# EAGLE schematic S130062_10HP_ECO_wd (EAGLE 6.5.0)

## Sheet 1 of 3
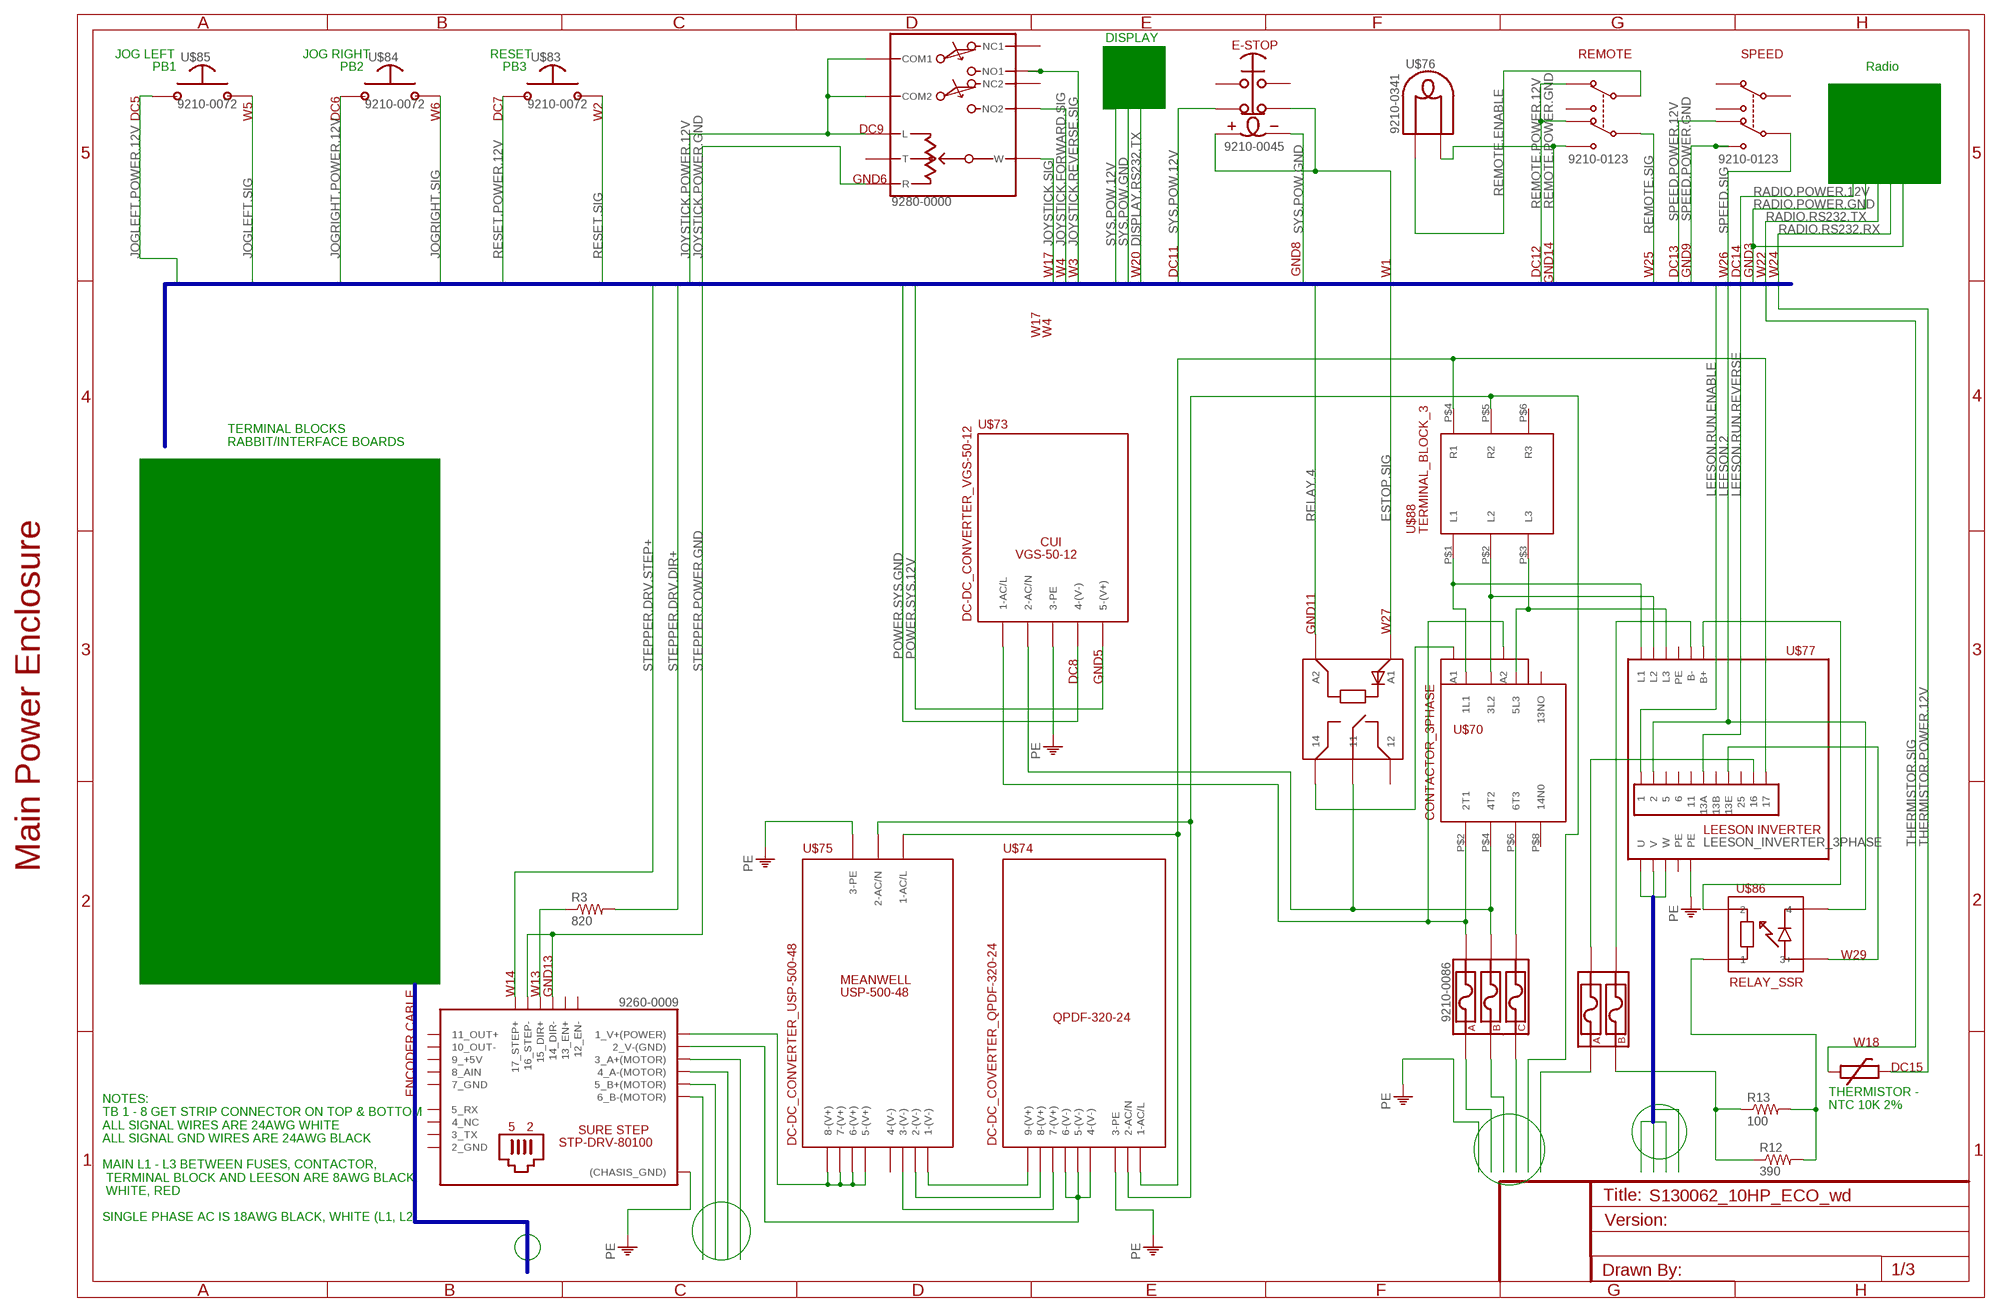
[diagram p0: schematic, sheet 1]

### Parts
R3  820  R-US_VTA52  [VTA52]
R12  390  R-US_VTA52  [VTA52]
R13  100  R-US_VTA52  [VTA52]
U$69  SURE_STEP_STP-DRV-80100  [BOGUS]
U$70  CONTACTOR_3PHASE  [BOGUS]
U$71  FUSE_HOLDER_3-POLE  [BOGUS]
U$72  9280-0000  JOYSTICK_PRO-5  [BOGUS]
U$73  DC-DC_CONVERTER_VGS-50-12  [BOGUS]
U$74  DC-DC_COVERTER_QPDF-320-24  [BOGUS]
U$75  DC-DC_CONVERTER_USP-500-48  [BOGUS]
U$76  9210-0341  INDICATOR_LIGHT  [BOGUS]
U$77  LEESON_INVERTER_3PHASE  [BOGUS]
U$78  THERMISTOR  [BOGUS]
U$79  9210-0045  SWITCH_ESTOP_LIGHTED  [BOGUS]
U$81  9210-0123  SWITCH_DPDT  [BOGUS]
U$82  9210-0123  SWITCH_DPDT  [BOGUS]
U$83  9210-0072  SWITCH_MOM_NO  [BOGUS]
U$84  9210-0072  SWITCH_MOM_NO  [BOGUS]
U$85  9210-0072  SWITCH_MOM_NO  [BOGUS]
U$86  RELAY_SSR  [BOGUS]
U$87  FUSE_HOLDER_2-POLE  [BOGUS]
U$88  TERMINAL_BLOCK_3  [BOGUS]
U$89  RELAY_TB  [BOGUS]

### Nets
B$5: U$77.P$20(U) U$77.P$21(V) U$77.P$22(W)
ESTOP.SIG: U$79.P$4 U$79.P$5 U$89.P$4(A1) ; also sheet 2
JOGLEFT.POWER.12V: U$85.P$1 ; also sheet 2
JOGLEFT.SIG: U$85.P$2 ; also sheet 2
JOGRIGHT.POWER.12V: U$84.P$1 ; also sheet 2
JOGRIGHT.SIG: U$84.P$2 ; also sheet 2
JOYSTICK.FORWARD.SIG: U$72.P$7(NO2) ; also sheet 2,3
JOYSTICK.POWER.12V: U$72.P$1(COM1) U$72.P$2(COM2) U$72.P$3(L) ; also sheet 2
JOYSTICK.POWER.GND: U$72.P$8(R) ; also sheet 2
JOYSTICK.REVERSE.SIG: U$72.P$6(NO1) ; also sheet 2,3
JOYSTICK.SIG: U$72.P$10(W) ; also sheet 2,3
LEESON.2: U$77.P$2 U$86.P$4 ; also sheet 2
LEESON.RUN.ENABLE: U$77.P$1
LEESON.RUN.REVERSE: U$77.P$6(13A)
MAINS.L1: U$74.P$1(1-AC/L) U$75.P$2(1-AC/L) U$77.P$10 U$88.P$4(R1)
MAINS.L2: U$74.P$2(2-AC/N) U$75.P$4(2-AC/N) U$88.P$5(R2)
MAINS.L3: U$70.P$5(5L3) U$77.P$16(L3) U$88.P$3(L3)
N$4: R3.1 U$69.P$16(15_DIR+)
N$5: R12.1 R13.1 U$87.P$1
N$87: U$70.P$9(A1) U$89.P$3
N$89: U$70.P$1(1L1) U$77.P$14(L1) U$88.P$1(L1)
N$91: U$70.P$3(3L2) U$77.P$15(L2) U$88.P$2(L2)
N$92: R12.2 R13.2 U$86.P$1
N$97: U$77.P$13(B-) U$87.P$4
N$141: U$70.P$2(2T1) U$70.P$10(A2) U$71.P$3 U$73.P$1(1-AC/L)
N$142: U$70.P$6(6T3) U$71.P$6
N$143: U$74.P$9(9-(V+)) U$75.P$1(1-(V-))
N$144: U$74.P$8(8-(V+)) U$75.P$3(2-(V-))
N$145: U$74.P$7(7-(V+)) U$75.P$5(3-(V-))
N$146: U$69.P$2(1_V+(POWER)) U$75.P$8(5-(V+)) U$75.P$9(6-(V+)) U$75.P$10(7-(V+)) U$75.P$11(8-(V+))
N$147: U$69.P$3(2_V-(GND)) U$74.P$4(4-(V-)) U$74.P$5(5-(V-)) U$74.P$6(6-(V-))
N$148: U$69.P$4(3_A+(MOTOR))
N$149: U$69.P$5(4_A-(MOTOR))
N$150: U$69.P$6(5_B+(MOTOR))
N$151: U$69.P$7(6_B-(MOTOR))
N$152: U$70.P$4(4T2) U$71.P$4 U$73.P$2(2-AC/N) U$89.P$1
N$153: U$71.P$5
N$154: U$77.P$12(B+) U$86.P$2
N$156: U$77.P$8(13E) U$86.P$3(3+)
N$158: U$77.P$9 U$87.P$3
N$159: U$87.P$2
N$166: U$71.P$2
N$167: U$71.P$1
PE: U$69.P$1((CHASIS_GND)) U$73.P$3(3-PE) U$74.P$3(3-PE) U$75.P$6(3-PE) U$77.P$19(PE)
POWER.SYS.12V: U$73.P$5(5-(V+)) ; also sheet 2
POWER.SYS.GND: U$73.P$4(4-(V-)) ; also sheet 2
RELAY.4: U$89.P$5(A2) ; also sheet 2
REMOTE.ENABLE: U$76.P$1 U$81.P$1
REMOTE.POWER.12V: U$81.P$2 U$81.P$5 ; also sheet 2
REMOTE.POWER.GND: U$76.P$2 U$81.P$6
REMOTE.SIG: U$81.P$4 ; also sheet 2,3
RESET.POWER.12V: U$83.P$1 ; also sheet 2
RESET.SIG: U$83.P$2 ; also sheet 2
SPEED.POWER.12V: U$82.P$5 ; also sheet 2
SPEED.POWER.GND: U$82.P$6 ; also sheet 2
SPEED.SIG: U$82.P$4 ; also sheet 2,3
STEPPER.DRV.DIR+: R3.2 ; also sheet 2,3
STEPPER.DRV.STEP+: U$69.P$18(17_STEP+) ; also sheet 2,3
STEPPER.POWER.GND: U$69.P$15(14_DIR-) U$69.P$17(16_STEP-) ; also sheet 2
SYS.POW.12V: U$79.P$2
SYS.POW.GND: U$79.P$6
THERMISTOR.POWER.12V: U$78.P$2 ; also sheet 2
THERMISTOR.SIG: U$78.P$1 ; also sheet 2,3
Unconnected: U$70.P$7(13NO) U$70.P$8(14N0) U$72.P$4(NC1) U$72.P$5(NC2) U$72.P$9(T) U$75.P$7(4-(V-)) U$77.P$3 U$77.P$4 U$77.P$5 U$77.P$7(13B) U$77.P$11 U$79.P$1 U$79.P$3 U$81.P$3 U$82.P$1 U$82.P$2 U$82.P$3 U$88.P$6(R3) U$89.P$2

### Buses
B$1
B$2
B$3

### Notes on the sheet
- DISPLAY
- JOG LEFT | JOG RIGHT | RESET | REMOTE | SPEED
- PB1 | PB2 | PB3 | Radio
- DC5 | W5 | DC6 | W6 | DC7 | W2
- DC9
- GND6
- W17 | W4 | W3 | W20 | DC11 | GND8 | W1 | DC12 | W25 | DC13 | GND9 | W26 | DC14 | GND3 | W22 | W24
- GND14
- W17 | W4
- TERMINAL BLOCKS
  RABBIT/INTERFACE BOARDS
- GND11 | W27
- DC8 | GND5
- Main Power Enclosure
- W29
- W14 | W13 | GND13
- W18
- DC15
- ENCODER CABLE
- THERMISTOR - 
  NTC 10K 2%
- NOTES:
  TB 1 - 8 GET STRIP CONNECTOR ON TOP & BOTTOM
  ALL SIGNAL WIRES ARE 24AWG WHITE
  ALL SIGNAL GND WIRES ARE 24AWG BLACK
  
  MAIN L1 - L3 BETWEEN FUSES, CONTACTOR,
   TERMINAL BLOCK AND LEESON ARE 8AWG BLACK,
   WHITE, RED
  
  SINGLE PHASE AC IS 18AWG BLACK, WHITE (L1, L2)

## Sheet 2 of 3
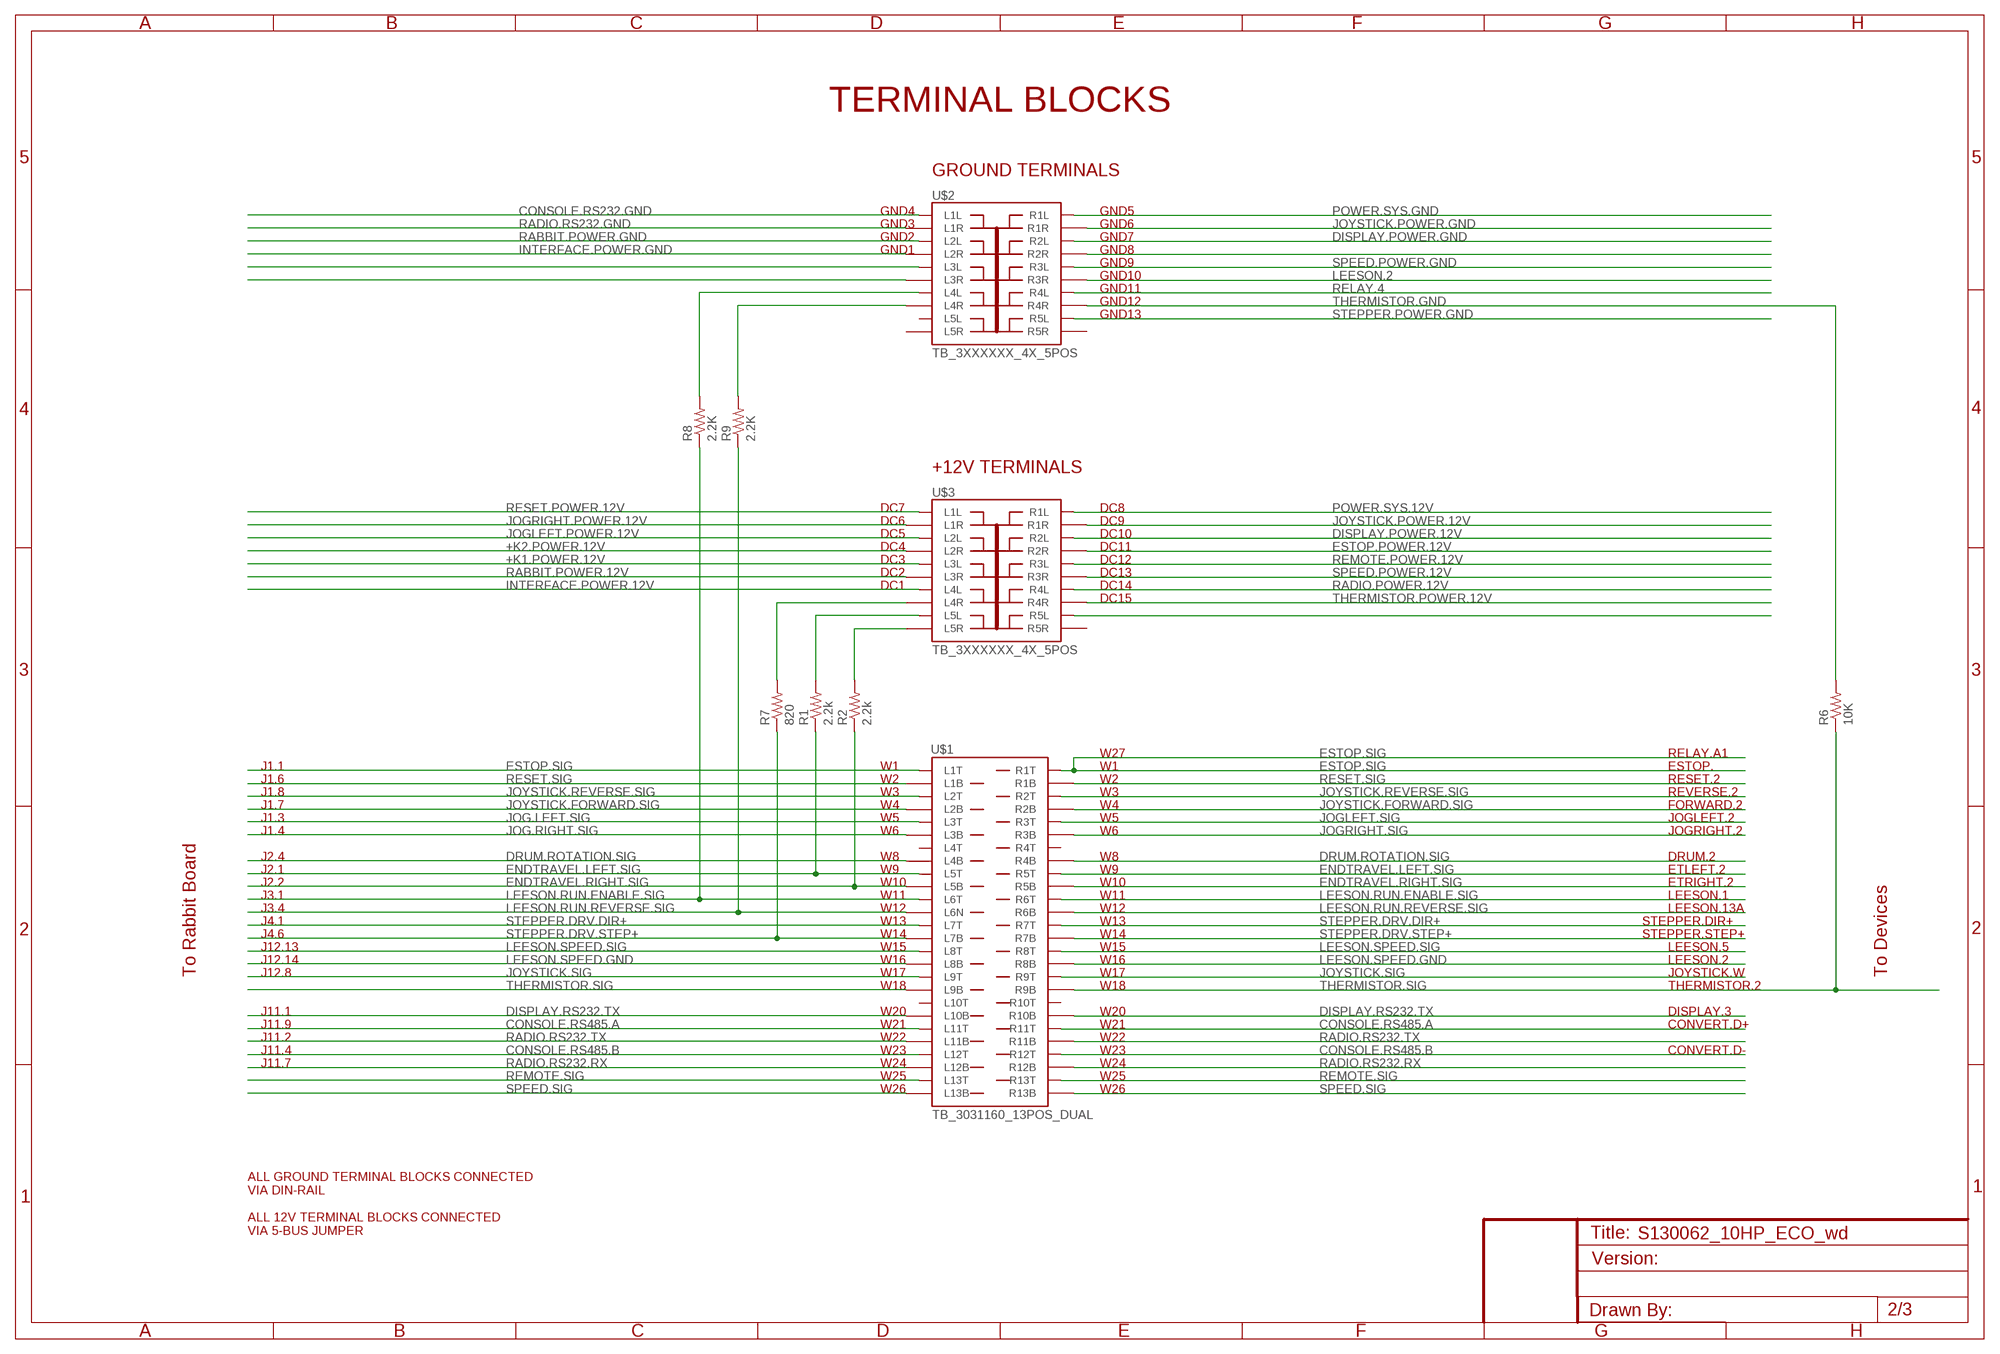
[diagram p1: schematic, sheet 2]

### Parts
R1  2.2k  R-US_V235/17  [V235/17]
R2  2.2k  R-US_V235/17  [V235/17]
R6  10K  R-US_V235/17  [V235/17]
R7  820  R-US_V235/17  [V235/17]
R8  2.2K  R-US_V235/17  [V235/17]
R9  2.2K  R-US_V235/17  [V235/17]
U$1  TB_3031160_13POS_DUAL  [BOGUS]
U$2  TB_3XXXXXX_4X_5POS  [BOGUS]
U$3  TB_3XXXXXX_4X_5POS  [BOGUS]

### Nets
+K1.POWER.12V: U$3.P$5(L3L) ; also sheet 3
+K2.POWER.12V: U$3.P$4(L2R) ; also sheet 3
CONSOLE.RS232.GND: U$2.P$1(L1L)
CONSOLE.RS485.A: U$1.P$22(L11T) U$1.P$48(R11T) ; also sheet 3
CONSOLE.RS485.B: U$1.P$24(L12T) U$1.P$50(R12T) ; also sheet 3
DISPLAY.POWER.12V: U$3.P$13(R2L)
DISPLAY.POWER.GND: U$2.P$13(R2L)
DISPLAY.RS232.TX: U$1.P$19(L10B) U$1.P$45(R10B) ; also sheet 1,3
DRUM.ROTATION.SIG: U$1.P$7(L4B) U$1.P$33(R4B) ; also sheet 3
ENDTRAVEL.LEFT.SIG: R1.1 U$1.P$10(L5T) U$1.P$36(R5T) ; also sheet 3
ENDTRAVEL.RIGHT.SIG: R2.1 U$1.P$9(L5B) U$1.P$35(R5B) ; also sheet 3
ESTOP.POWER.12V: U$3.P$14(R2R)
ESTOP.SIG: U$1.P$2(L1T) U$1.P$28(R1T) ; also sheet 1
INTERFACE.POWER.12V: U$3.P$7(L4L) ; also sheet 3
INTERFACE.POWER.GND: U$2.P$4(L2R) ; also sheet 3
JOG.LEFT.SIG: U$1.P$6(L3T)
JOG.RIGHT.SIG: U$1.P$5(L3B)
JOGLEFT.POWER.12V: U$3.P$3(L2L) ; also sheet 1
JOGLEFT.SIG: U$1.P$32(R3T) ; also sheet 1
JOGRIGHT.POWER.12V: U$3.P$2(L1R) ; also sheet 1
JOGRIGHT.SIG: U$1.P$31(R3B) ; also sheet 1
JOYSTICK.FORWARD.SIG: U$1.P$3(L2B) U$1.P$29(R2B) ; also sheet 1,3
JOYSTICK.POWER.12V: U$3.P$12(R1R) ; also sheet 1
JOYSTICK.POWER.GND: U$2.P$12(R1R) ; also sheet 1
JOYSTICK.REVERSE.SIG: U$1.P$4(L2T) U$1.P$30(R2T) ; also sheet 1,3
JOYSTICK.SIG: U$1.P$18(L9T) U$1.P$44(R9T) ; also sheet 1,3
LEESON.2: U$2.P$16(R3R) ; also sheet 1
LEESON.RUN.ENABLE.SIG: R8.1 U$1.P$12(L6T) U$1.P$38(R6T) ; also sheet 3
LEESON.RUN.REVERSE.SIG: R9.1 U$1.P$11(L6N) U$1.P$37(R6B) ; also sheet 3
LEESON.SPEED.GND: U$1.P$15(L8B) U$1.P$41(R8B) ; also sheet 3
LEESON.SPEED.SIG: U$1.P$16(L8T) U$1.P$42(R8T) ; also sheet 3
N$1: U$3.P$19(R5L)
N$2: R1.2 U$3.P$9(L5L)
N$3: R2.2 U$3.P$10(L5R)
N$77: U$2.P$14(R2R)
N$104: U$2.P$5(L3L)
N$105: U$2.P$6(L3R)
N$106: R8.2 U$2.P$7(L4L)
N$107: R9.2 U$2.P$8(L4R)
N$117: R7.2 U$3.P$8(L4R)
POWER.SYS.12V: U$3.P$11(R1L) ; also sheet 1
POWER.SYS.GND: U$2.P$11(R1L) ; also sheet 1
RABBIT.POWER.12V: U$3.P$6(L3R) ; also sheet 3
RABBIT.POWER.GND: U$2.P$3(L2L) ; also sheet 3
RADIO.POWER.12V: U$3.P$17(R4L) ; also sheet 1
RADIO.RS232.GND: U$2.P$2(L1R)
RADIO.RS232.RX: U$1.P$23(L12B) U$1.P$49(R12B) ; also sheet 1,3
RADIO.RS232.TX: U$1.P$21(L11B) U$1.P$47(R11B) ; also sheet 1,3
RELAY.4: U$2.P$17(R4L) ; also sheet 1
REMOTE.POWER.12V: U$3.P$15(R3L) ; also sheet 1
REMOTE.SIG: U$1.P$26(L13T) U$1.P$52(R13T) ; also sheet 1,3
RESET.POWER.12V: U$3.P$1(L1L) ; also sheet 1
RESET.SIG: U$1.P$1(L1B) U$1.P$27(R1B) ; also sheet 1
SPEED.POWER.12V: U$3.P$16(R3R) ; also sheet 1
SPEED.POWER.GND: U$2.P$15(R3L) ; also sheet 1
SPEED.SIG: U$1.P$25(L13B) U$1.P$51(R13B) ; also sheet 1,3
STEPPER.DRV.DIR+: U$1.P$14(L7T) U$1.P$40(R7T) ; also sheet 1,3
STEPPER.DRV.STEP+: R7.1 U$1.P$13(L7B) U$1.P$39(R7B) ; also sheet 1,3
STEPPER.POWER.GND: U$2.P$19(R5L) ; also sheet 1
THERMISTOR.GND: R6.2 U$2.P$18(R4R)
THERMISTOR.POWER.12V: U$3.P$18(R4R) ; also sheet 1
THERMISTOR.SIG: R6.1 U$1.P$17(L9B) U$1.P$43(R9B) ; also sheet 1,3
Unconnected: U$1.P$8(L4T) U$1.P$20(L10T) U$1.P$34(R4T) U$1.P$46(R10T) U$2.P$9(L5L) U$2.P$10(L5R) U$2.P$20(R5R) U$3.P$20(R5R)

### Notes on the sheet
- TERMINAL BLOCKS
- GROUND TERMINALS
- GND4 | GND5
- GND3 | GND6
- GND2 | GND7
- GND1 | GND8
- GND9
- GND10
- GND11
- GND12
- GND13
- +12V TERMINALS
- DC7 | DC8
- DC6 | DC9
- DC5 | DC10
- DC4 | DC11
- DC3 | DC12
- DC2 | DC13
- DC1 | DC14
- DC15
- W27 | RELAY.A1
- J1.1 | W1 | W1 | ESTOP.
- J1.6 | W2 | W2 | RESET.2
- J1.8 | W3 | W3 | REVERSE.2
- J1.7 | W4 | W4 | FORWARD.2
- J1.3 | W5 | W5 | JOGLEFT.2
- J1.4 | W6 | W6 | JOGRIGHT.2
- J2.4 | W8 | W8 | DRUM.2
- J2.1 | W9 | W9 | ETLEFT.2
- J2.2 | W10 | W10 | ETRIGHT.2
- J3.1 | W11 | W11 | LEESON.1
- J3.4 | W12 | W12 | LEESON.13A
- J4.1 | W13 | W13 | STEPPER.DIR+
- J4.6 | W14 | W14 | STEPPER.STEP+
- J12.13 | W15 | W15 | LEESON.5
- J12.14 | W16 | W16 | LEESON.2
- To Rabbit Board | J12.8 | W17 | W17 | JOYSTICK.W | To Devices
- W18 | W18 | THERMISTOR.2
- J11.1 | W20 | W20 | DISPLAY.3
- J11.9 | W21 | W21 | CONVERT.D+
- J11.2 | W22 | W22
- J11.4 | W23 | W23 | CONVERT.D-
- J11.7 | W24 | W24
- W25 | W25
- W26 | W26
- ALL GROUND TERMINAL BLOCKS CONNECTED
  VIA DIN-RAIL 
  
  ALL 12V TERMINAL BLOCKS CONNECTED 
  VIA 5-BUS JUMPER

## Sheet 3 of 3
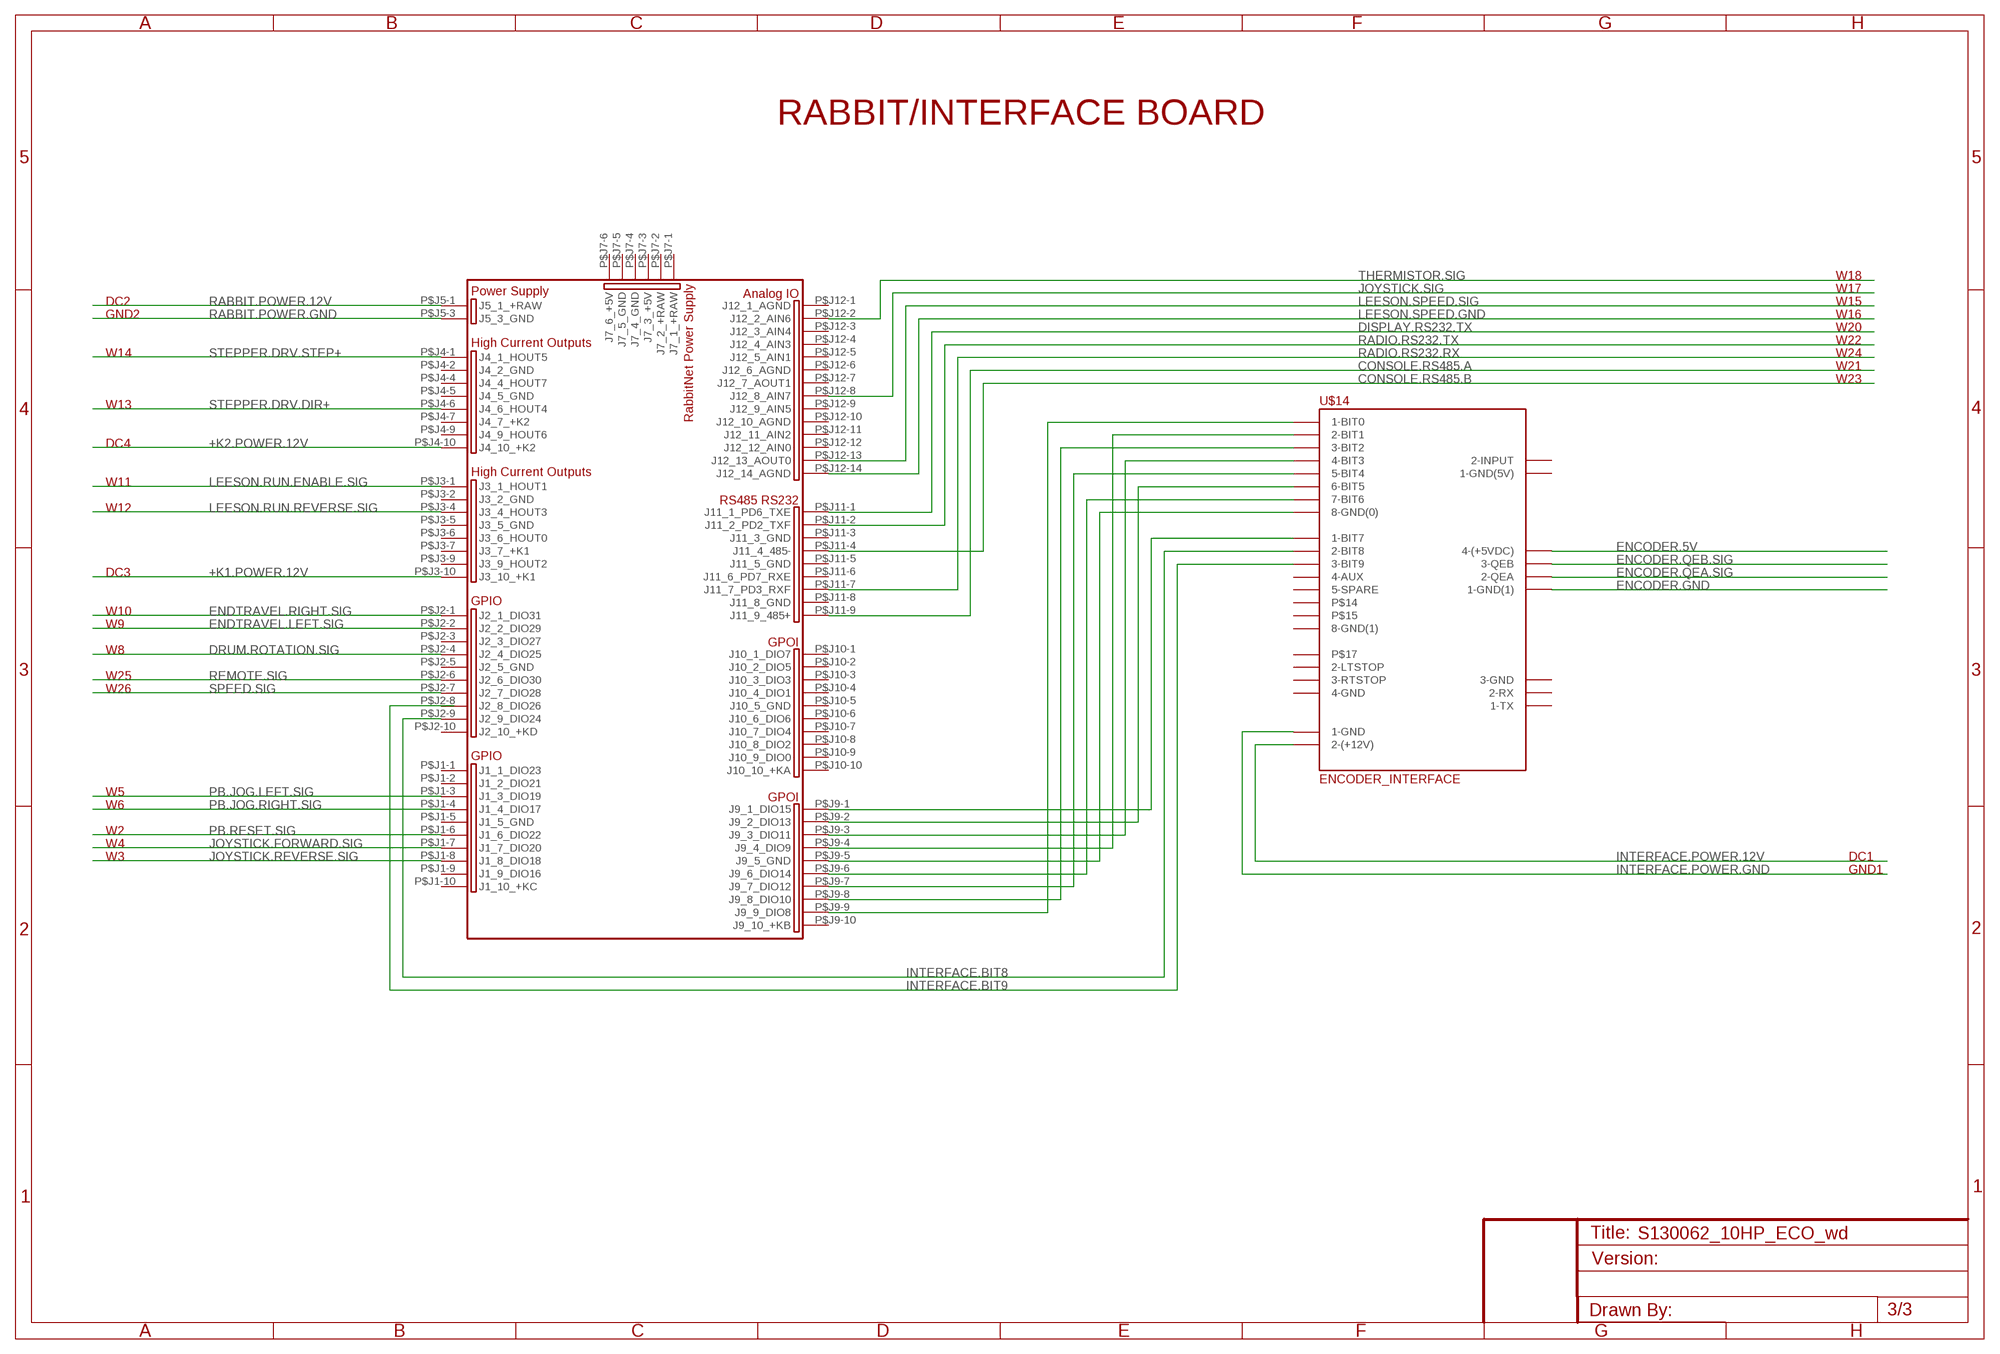
[diagram p2: schematic, sheet 3]

### Parts
U$14  ENCODER_INTERFACE  [BOGUS]
U$15  RABBIT_BL4S200(RCM4310)  [RABBIT_BL4S200]

### Nets
+K1.POWER.12V: U$15.P$J3-10(J3_10_+K1) ; also sheet 2
+K2.POWER.12V: U$15.P$J4-10(J4_10_+K2) ; also sheet 2
CONSOLE.RS485.A: U$15.P$J11-9(J11_9_485+) ; also sheet 2
CONSOLE.RS485.B: U$15.P$J11-4(J11_4_485-) ; also sheet 2
DISPLAY.RS232.TX: U$15.P$J11-1(J11_1_PD6_TXE) ; also sheet 1,2
DRUM.ROTATION.SIG: U$15.P$J2-4(J2_4_DIO25) ; also sheet 2
ENCODER.5V: U$14.P$19(4-(+5VDC))
ENCODER.GND: U$14.P$4(1-GND(1))
ENCODER.QEA.SIG: U$14.P$12(2-QEA)
ENCODER.QEB.SIG: U$14.P$17(3-QEB)
ENDTRAVEL.LEFT.SIG: U$15.P$J2-2(J2_2_DIO29) ; also sheet 2
ENDTRAVEL.RIGHT.SIG: U$15.P$J2-1(J2_1_DIO31) ; also sheet 2
INTERFACE.BIT7: U$14.P$2(1-BIT7) U$15.P$J9-1(J9_1_DIO15)
INTERFACE.BIT8: U$14.P$9(2-BIT8) U$15.P$J2-9(J2_9_DIO24)
INTERFACE.BIT9: U$14.P$15(3-BIT9)
INTERFACE.GND: U$14.P$27(8-GND(0)) U$15.P$J9-5(J9_5_GND)
INTERFACE.POWER.12V: U$14.P$7(2-(+12V)) ; also sheet 2
INTERFACE.POWER.GND: U$14.P$3(1-GND) ; also sheet 2
JOYSTICK.FORWARD.SIG: U$15.P$J1-7(J1_7_DIO20) ; also sheet 1,2
JOYSTICK.REVERSE.SIG: U$15.P$J1-8(J1_8_DIO18) ; also sheet 1,2
JOYSTICK.SIG: U$15.P$J12-8(J12_8_AIN7) ; also sheet 1,2
LEESON.RUN.ENABLE.SIG: U$15.P$J3-1(J3_1_HOUT1) ; also sheet 2
LEESON.RUN.REVERSE.SIG: U$15.P$J3-4(J3_4_HOUT3) ; also sheet 2
LEESON.SPEED.GND: U$15.P$J12-14(J12_14_AGND) ; also sheet 2
LEESON.SPEED.SIG: U$15.P$J12-13(J12_13_AOUT0) ; also sheet 2
N$71: U$14.P$25(6-BIT5) U$15.P$J9-2(J9_2_DIO13)
N$78: U$14.P$21(4-BIT3) U$15.P$J9-3(J9_3_DIO11)
N$79: U$14.P$8(2-BIT1) U$15.P$J9-4(J9_4_DIO9)
N$80: U$14.P$26(7-BIT6) U$15.P$J9-6(J9_6_DIO14)
N$85: U$14.P$23(5-BIT4) U$15.P$J9-7(J9_7_DIO12)
N$86: U$14.P$14(3-BIT2) U$15.P$J9-8(J9_8_DIO10)
N$90: U$14.P$1(1-BIT0) U$15.P$J9-9(J9_9_DIO8)
PB.JOG.LEFT.SIG: U$15.P$J1-3(J1_3_DIO19)
PB.JOG.RIGHT.SIG: U$15.P$J1-4(J1_4_DIO17)
PB.RESET.SIG: U$15.P$J1-6(J1_6_DIO22)
RABBIT.POWER.12V: U$15.P$J5-1(J5_1_+RAW) ; also sheet 2
RABBIT.POWER.GND: U$15.P$J5-3(J5_3_GND) ; also sheet 2
RADIO.RS232.RX: U$15.P$J11-7(J11_7_PD3_RXF) ; also sheet 1,2
RADIO.RS232.TX: U$15.P$J11-2(J11_2_PD2_TXF) ; also sheet 1,2
REMOTE.SIG: U$15.P$J2-6(J2_6_DIO30) ; also sheet 1,2
SPEED.SIG: U$15.P$J2-7(J2_7_DIO28) ; also sheet 1,2
STEPPER.DRV.DIR+: U$15.P$J4-6(J4_6_HOUT4) ; also sheet 1,2
STEPPER.DRV.STEP+: U$15.P$J4-1(J4_1_HOUT5) ; also sheet 1,2
THERMISTOR.SIG: U$15.P$J12-2(J12_2_AIN6) ; also sheet 1,2
Unconnected: U$14.P$5(1-GND(5V)) U$14.P$6(1-TX) U$14.P$10(2-INPUT) U$14.P$11(2-LTSTOP) U$14.P$13(2-RX) U$14.P$16(3-GND) U$14.P$18(3-RTSTOP) U$14.P$20(4-AUX) U$14.P$22(4-GND) U$14.P$24(5-SPARE) U$14.P$29 U$14.P$30 U$14.P$31 U$15.P$J1-1(J1_1_DIO23) U$15.P$J1-2(J1_2_DIO21) U$15.P$J1-5(J1_5_GND) U$15.P$J1-9(J1_9_DIO16) U$15.P$J1-10(J1_10_+KC) U$15.P$J2-3(J2_3_DIO27) U$15.P$J2-5(J2_5_GND) U$15.P$J2-8(J2_8_DIO26) U$15.P$J2-10(J2_10_+KD) U$15.P$J3-2(J3_2_GND) U$15.P$J3-5(J3_5_GND) U$15.P$J3-6(J3_6_HOUT0) U$15.P$J3-7(J3_7_+K1) U$15.P$J3-9(J3_9_HOUT2) U$15.P$J4-2(J4_2_GND) U$15.P$J4-4(J4_4_HOUT7) U$15.P$J4-5(J4_5_GND) U$15.P$J4-7(J4_7_+K2) U$15.P$J4-9(J4_9_HOUT6) U$15.P$J7-1(J7_1_+RAW) U$15.P$J7-2(J7_2_+RAW) U$15.P$J7-3(J7_3_+5V) U$15.P$J7-4(J7_4_GND) U$15.P$J7-5(J7_5_GND) U$15.P$J7-6(J7_6_+5V) U$15.P$J9-10(J9_10_+KB) U$15.P$J10-1(J10_1_DIO7) U$15.P$J10-2(J10_2_DIO5) U$15.P$J10-3(J10_3_DIO3) U$15.P$J10-4(J10_4_DIO1) U$15.P$J10-5(J10_5_GND) U$15.P$J10-6(J10_6_DIO6) U$15.P$J10-7(J10_7_DIO4) U$15.P$J10-8(J10_8_DIO2) U$15.P$J10-9(J10_9_DIO0) U$15.P$J10-10(J10_10_+KA) U$15.P$J11-3(J11_3_GND) U$15.P$J11-5(J11_5_GND) U$15.P$J11-6(J11_6_PD7_RXE) U$15.P$J11-8(J11_8_GND) U$15.P$J12-1(J12_1_AGND) U$15.P$J12-3(J12_3_AIN4) U$15.P$J12-4(J12_4_AIN3) U$15.P$J12-5(J12_5_AIN1) U$15.P$J12-6(J12_6_AGND) U$15.P$J12-7(J12_7_AOUT1) U$15.P$J12-9(J12_9_AIN5) U$15.P$J12-10(J12_10_AGND) U$15.P$J12-11(J12_11_AIN2) U$15.P$J12-12(J12_12_AIN0)

### Notes on the sheet
- RABBIT/INTERFACE BOARD
- W18
- W17
- DC2 | W15
- GND2 | W16
- W20
- W22
- W14 | W24
- W21
- W23
- W13
- DC4
- W11
- W12
- DC3
- W10
- W9
- W8
- W25
- W26
- W5
- W6
- W2
- W4
- W3 | DC1
- GND1

## Power pins joined to a net without a drawn wire
2_GND: U$69.P$19(2_GND)
3_TX: U$69.P$20(3_TX)
4_NC: U$69.P$21(4_NC)
5_RX: U$69.P$22(5_RX)
7_GND: U$69.P$8(7_GND)
8-GND(1): U$14.P$28(8-GND(1))
8_AIN: U$69.P$9(8_AIN)
9_+5V: U$69.P$10(9_+5V)
10_OUT-: U$69.P$11(10_OUT-)
11_OUT+: U$69.P$12(11_OUT+)
12_EN-: U$69.P$13(12_EN-)
13_EN+: U$69.P$14(13_EN+)
PE: U$77.P$17(PE) U$77.P$18(PE)

## Library data of the parts
R1 R2 R6-R9 = resistor:R-US_: RESISTOR, American symbol
R3 R12 R13 = rcl:R-US_: RESISTOR, American symbol
U$1 = SOSI-TerminalBlocks:TB_3031160_13POS_DUAL
U$2 U$3 = SOSI-TerminalBlocks:TB_3XXXXXX_4X_5POS
U$14 = DougM-SOSI-Wiring-Diagram.rpt:ENCODER_INTERFACE
U$15 = DougM.SOSI.Microcontroller:RABBIT_BL4S200(RCM4310): 9210-0442 COMPUTER SINGLE-BOARD BL4S200 Rabbit Semiconductor 20-101-1220 Digi-Key 316-1164-ND
U$69 = DougM-SOSI-Wiring-Diagram.rpt:SURE_STEP_STP-DRV-80100: 9260-0009 STP-DRV-80100 Step Motor Driver, 80 V 10A Sure Step Automation Direct
U$70 = DougM-SOSI-Wiring-Diagram.rpt:CONTACTOR_3PHASE
U$71 = DougM-SOSI-Wiring-Diagram.rpt:FUSE_HOLDER_3-POLE: 9210-0086 BC6033PQ Fuseholder, Class CC & Class G, 3 pole, 600V, 30A, for 13/32x1 1/2 fuses Cooper/Bussman North Coast Electric
U$72 = DougM-SOSI-Wiring-Diagram.rpt:JOYSTICK_PRO-5: 9280-0000 PRO5-202.1085 (w/20k center tap potentiometer) Joystick (Master Switch), w/20k center tap potentiometer J. R. Merritt Controls
U$73 = DougM-SOSI-Wiring-Diagram.rpt:DC-DC_CONVERTER_VGS-50-12
U$74 = DougM-SOSI-Wiring-Diagram.rpt:DC-DC_COVERTER_QPDF-320-24
U$75 = DougM-SOSI-Wiring-Diagram.rpt:DC-DC_CONVERTER_USP-500-48
U$76 = DougM-SOSI-Wiring-Diagram.rpt:INDICATOR_LIGHT: 9210-0341 OMPBD7D-P3N3 Indicator Light, LED, Complete Asssembly, 22.5mm, IP66, 24V AC/DC Omega www.omega.com
U$77 = DougM-SOSI-Wiring-Diagram.rpt:LEESON_INVERTER_3PHASE
U$78 = DougM-SOSI-Wiring-Diagram.rpt:THERMISTOR: (no PN available) (no description available) Soundnine Inc. (no vendor PN available)
U$79 = DougM-SOSI-Wiring-Diagram.rpt:SWITCH_ESTOP_LIGHTED: 9210-0045 Switch, Emergency Stop, w/ #800T-XA4 contact block (old #800H-FRXTQH10RA4) Allen Bradley 800H-FRXTQH2RA4
U$81 U$82 = DougM-SOSI-Wiring-Diagram.rpt:SWITCH_DPDT: 9210-0123 Switch, Non-Illuminated, 30.5mm, Type 4/4x/13, 2 Pos. Selector, Std. Knob Maint, 1 N.O.-1 N.C., WHITE 9210-0175?? Switch, Selector, 2-Position, Maintained, Blk handle w/ wht insert (old #800H-24HRAH2KB6AX)
U$83-U$85 = DougM-SOSI-Wiring-Diagram.rpt:SWITCH_MOM_NO: 9210-0072 Mouser Part #: 850-59-313 Manufacturer Part #: 59-313
U$86 = DougM-SOSI-Wiring-Diagram.rpt:RELAY_SSR
U$87 = DougM-SOSI-Wiring-Diagram.rpt:FUSE_HOLDER_2-POLE: 9210-0047 Cooper/Bussman BM6032SQ 9210-0194 Cooper/Bussman BK/S-8301-2-R
U$88 = DougM-SOSI-Wiring-Diagram.rpt:TERMINAL_BLOCK_3
U$89 = DougM-SOSI-Wiring-Diagram.rpt:RELAY_TB